# EAGLE design ir_remote_controlled_veh (EAGLE 9.0.1)
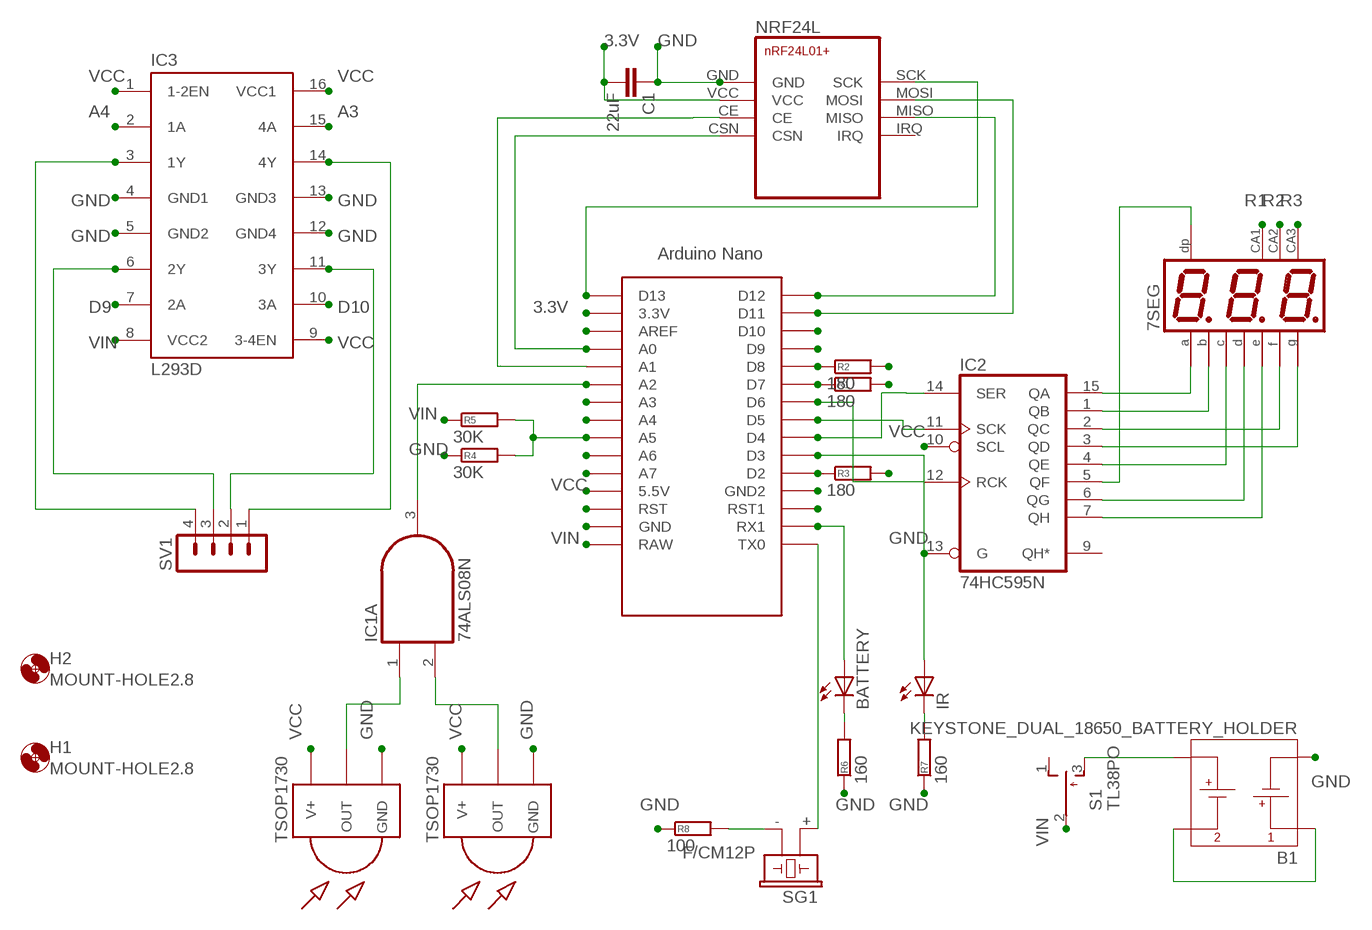
[diagram p0: schematic, sheet 1]

## Parts
7SEG  BA56-12EWA  [BA56-12EWA]
B1  KEYSTONE_DUAL_18650_BATTERY_HOLDER  [KEYSTONE_1049_DUAL_18650_HOLDER]
BATTERY  LED5MM  [LED5MM]
C1  22uF  C-EU025-040X050  [C025-040X050]
H1  MOUNT-HOLE2.8  [2,8]
H2  MOUNT-HOLE2.8  [2,8]
IC1  74ALS08N  [DIL14]
IC2  74HC595N  [DIL16]
IC3  L293D  [DIL16]
IR  LED5MM  [LED5MM]
NRF24L  NRF24L01+  [NRF24L01+]
R1  180  R-EU_0204/7  [0204/7]
R2  180  R-EU_0204/7  [0204/7]
R3  180  R-EU_0204/7  [0204/7]
R4  30K  R-EU_0204/7  [0204/7]
R5  30K  R-EU_0204/7  [0204/7]
R6  160  R-EU_0204/7  [0204/7]
R7  160  R-EU_0204/7  [0204/7]
R8  100  R-EU_0204/7  [0204/7]
S1  TL38PO  [TL3XPO]
SG1  F/CM12P  [F/CM12P]
SV1  MA04-1  [MA04-1]
TSOP1  TSOP1730  [TSOP17XX]
TSOP2  TSOP1730  [TSOP17XX]
U$1  NANO  [NANO]

## Nets
3.3V: C1.2 NRF24L.VCC U$1.3.3V
A0: NRF24L.CSN U$1.A0
A1: NRF24L.CE U$1.A1
A2: IC1.3(A:O) U$1.A2
A3: IC3.15(4A) U$1.A3
A4: IC3.2(1A) U$1.A4
A5: R4.2 R5.2 U$1.A5
D2: R3.1 U$1.D2
D3: IR.A U$1.D3
D4: IC2.14(SER) U$1.D4
D5: IC2.11(SCK) U$1.D5
D6: IC2.12(RCK) U$1.D6
D7: R1.1 U$1.D7
D8: R2.1 U$1.D8
D9: IC3.7(2A) U$1.D9
D10: IC3.10(3A) U$1.D10
D11: NRF24L.MOSI U$1.D11
D12: NRF24L.MISO U$1.D12
D13: NRF24L.SCK U$1.D13
GND: B1.C1_N(1_N) C1.1 IC2.13(G) IC3.4(GND1) IC3.5(GND2) IC3.12(GND4) IC3.13(GND3) NRF24L.GND R4.1 R6.1 R7.1 R8.1 TSOP1.GND TSOP2.GND U$1.GND U$1.GND1(GND2)
N$1: 7SEG.P$11(A) IC2.15(QA)
N$2: 7SEG.P$7(B) IC2.1(QB)
N$3: 7SEG.P$10(F) IC2.2(QC)
N$4: 7SEG.P$5(G) IC2.3(QD)
N$5: 7SEG.P$4(C) IC2.4(QE)
N$6: 7SEG.P$3(DP) IC2.5(QF)
N$7: 7SEG.P$2(D) IC2.6(QG)
N$8: 7SEG.P$1(E) IC2.7(QH)
N$9: B1.C1_P(1_P) B1.C2_N(2_N)
N$12: B1.C2_P(2_P) S1.3(S)
N$13: U$1.RST1
N$15: SG1.+ U$1.TX0
N$16: BATTERY.K(C) R6.2
N$17: IR.K(C) R7.2
N$18: U$1.RST
N$19: R8.2 SG1.-
N$20: U$1.A7
N$21: U$1.A6
N$23: IC1.1(A:I0) TSOP1.OUT
N$24: IC1.2(A:I1) TSOP2.OUT
N$27: IC3.6(2Y) SV1.3
N$30: U$1.AREF
N$32: IC3.3(1Y) SV1.4
N$37: IC3.14(4Y) SV1.1
N$41: IC3.11(3Y) SV1.2
R1: 7SEG.P$8(CA) R1.2
R2: 7SEG.P$9(CA) R2.2
R3: 7SEG.P$12(CA) R3.2
RX1: BATTERY.A U$1.RX1
VCC: IC2.10(SCL) IC3.1(1-2EN) IC3.9(3-4EN) IC3.16(VCC1) TSOP1.V+ TSOP2.V+ U$1.5V(5.5V)
VIN: IC3.8(VCC2) R5.1 S1.2(P) U$1.RAW
Unconnected: IC1.4(B:I0) IC1.5(B:I1) IC1.6(B:O) IC1.8(C:O) IC1.9(C:I0) IC1.10(C:I1) IC1.11(D:O) IC1.12(D:I0) IC1.13(D:I1) IC2.9(QH*) NRF24L.IRQ S1.1(O)

## Power pins joined to a net without a drawn wire
GND: IC1.7(P:GND) IC2.8(GND)
VCC: IC1.14(P:VCC) IC2.16(VCC)

## Library data of the parts
7SEG = dd_7segment:BA56-12EWA
B1 = dd_goldpin:KEYSTONE_DUAL_18650_BATTERY_HOLDER: Keystone Electronics Dual 18650 Battery Holder Heat-resistant nylon 18650 battery holder with 4 through-hole terminals. Octopart Search <https://octopart.com/search?q=keystone+1049> Added 2017-02-21; MANUF: Keystone Electronics; PARTNUM: 1049
BATTERY IR = dd_led:LED: LED OSRAM: - CHIPLED LG R971, LG N971, LY N971, LG Q971, LY Q971, LO R971, LY R971 LH N974, LH R974 LS Q976, LO Q976, LY Q976 LO Q996 - Hyper CHIPLED LW Q18S LB Q993, LB Q99A, LB R99A - SideLED LS A670, LO A670, LY A670, LG A670, LP A670 LB A673, LV A673, LT A673, LW A673 LH A674 LY A675 LS A676, LA A676, LO A676, LY A676, LW A676 LS A679, LY A679, LG A679 - Hyper Micro SIDELED® LS Y876, LA Y876, LO Y876, LY Y876 LT Y87S - SmartLED LW L88C, LW L88S LB L89C, LB L89S, LG L890 LS L89K, LO L89K, LY L89K LS L896, LA L896, LO L896, LY L896 - TOPLED LS T670, LO T670, LY T670, LG T670, LP T670 LSG T670, LSP T670, LSY T670, LOP T670, LYG T670 LG T671, LOG T671, LSG T671 LB T673, LV T673, LT T673, LW T673 LH T674 LS T676, LA T676, LO T676, LY T676, LB T676, LH T676, LSB T676, LW T676 LB T67C, LV T67C, LT T67C, LS T67K, LO T67K, LY T67K, LW E67C LS E67B, LA E67B, LO E67B, LY E67B, LB E67C, LV E67C, LT E67C LW T67C LS T679, LY T679, LG T679 LS T770, LO T770, LY T770, LG T770, LP T770 LB T773, LV T773, LT T773, LW T773 LH T774 LS E675, LA E675, LY E675, LS T675 LS T776, LA T776, LO T776, LY T776, LB T776 LHGB T686 LT T68C, LB T68C - Hyper Mini TOPLED® LB M676 - Mini TOPLED Santana® LG M470 LS M47K, LO M47K, LY M47K Source: http://www.osram.convergy.de LUXEON: - LUMILED® LXK2-PW12-R00, LXK2-PW12-S00, LXK2-PW14-U00, LXK2-PW14-V00 LXK2-PM12-R00, LXK2-PM12-S00, LXK2-PM14-U00 LXK2-PE12-Q00, LXK2-PE12-R00, LXK2-PE12-S00, LXK2-PE14-T00, LXK2-PE14-U00 LXK2-PB12-K00, LXK2-PB12-L00, LXK2-PB12-M00, LXK2-PB14-N00, LXK2-PB14-P00, LXK2-PB14-Q00 LXK2-PR12-L00, LXK2-PR12-M00, LXK2-PR14-Q00, LXK2-PR14-R00 LXK2-PD12-Q00, LXK2-PD12-R00, LXK2-PD12-S00 LXK2-PH12-R00, LXK2-PH12-S00 LXK2-PL12-P00, LXK2-PL12-Q00, LXK2-PL12-R00 Source: www.luxeon.com KINGBRIGHT: KA-3528ASYC Source: www.kingbright.com
C1 = dd_goldpin:C-EU: CAPACITOR, European symbol
H1 H2 = holes:MOUNT-HOLE: MOUNTING HOLE with drill center marker
IC1 = dd_AND_gate:74*08: Quad 2-input AND gate
IC2 = dd_shift_register:74*595: 8-bit SHIFT REGISTER, output latch
IC3 = dd_293d:L293D: PUSH-PULL 4 CHANNEL DRIVER; MPN: L293D; OC_FARNELL: 9589619; OC_NEWARK: 56P8249
NRF24L = dd_nrf:NRF24L01+: nRF24L01+ Transceiver Module
R1-R8 = dd_resistor:R-EU_: RESISTOR, European symbol
S1 = dd_goldpin:TL38PO: TINY SWITCH ON OFF MOM Source: http://www2.produktinfo.conrad.com/datenblaetter/700000-724999/705152-da-01-de-Subminiaturschalter_TL_36YO.pdf
SG1 = dd_goldpin:F/CM12P: BUZZER Source: Buerklin; OC_FARNELL: unknown; OC_NEWARK: unknown
SV1 = dd_goldpin:MA04-1: PIN HEADER; OC_FARNELL: unknown; OC_NEWARK: unknown
TSOP1 TSOP2 = dd_tsop-1:TSOP1730: IR Receiver and Demodulator
U$1 = dd_nano:NANO: Arduino Nano

## Board
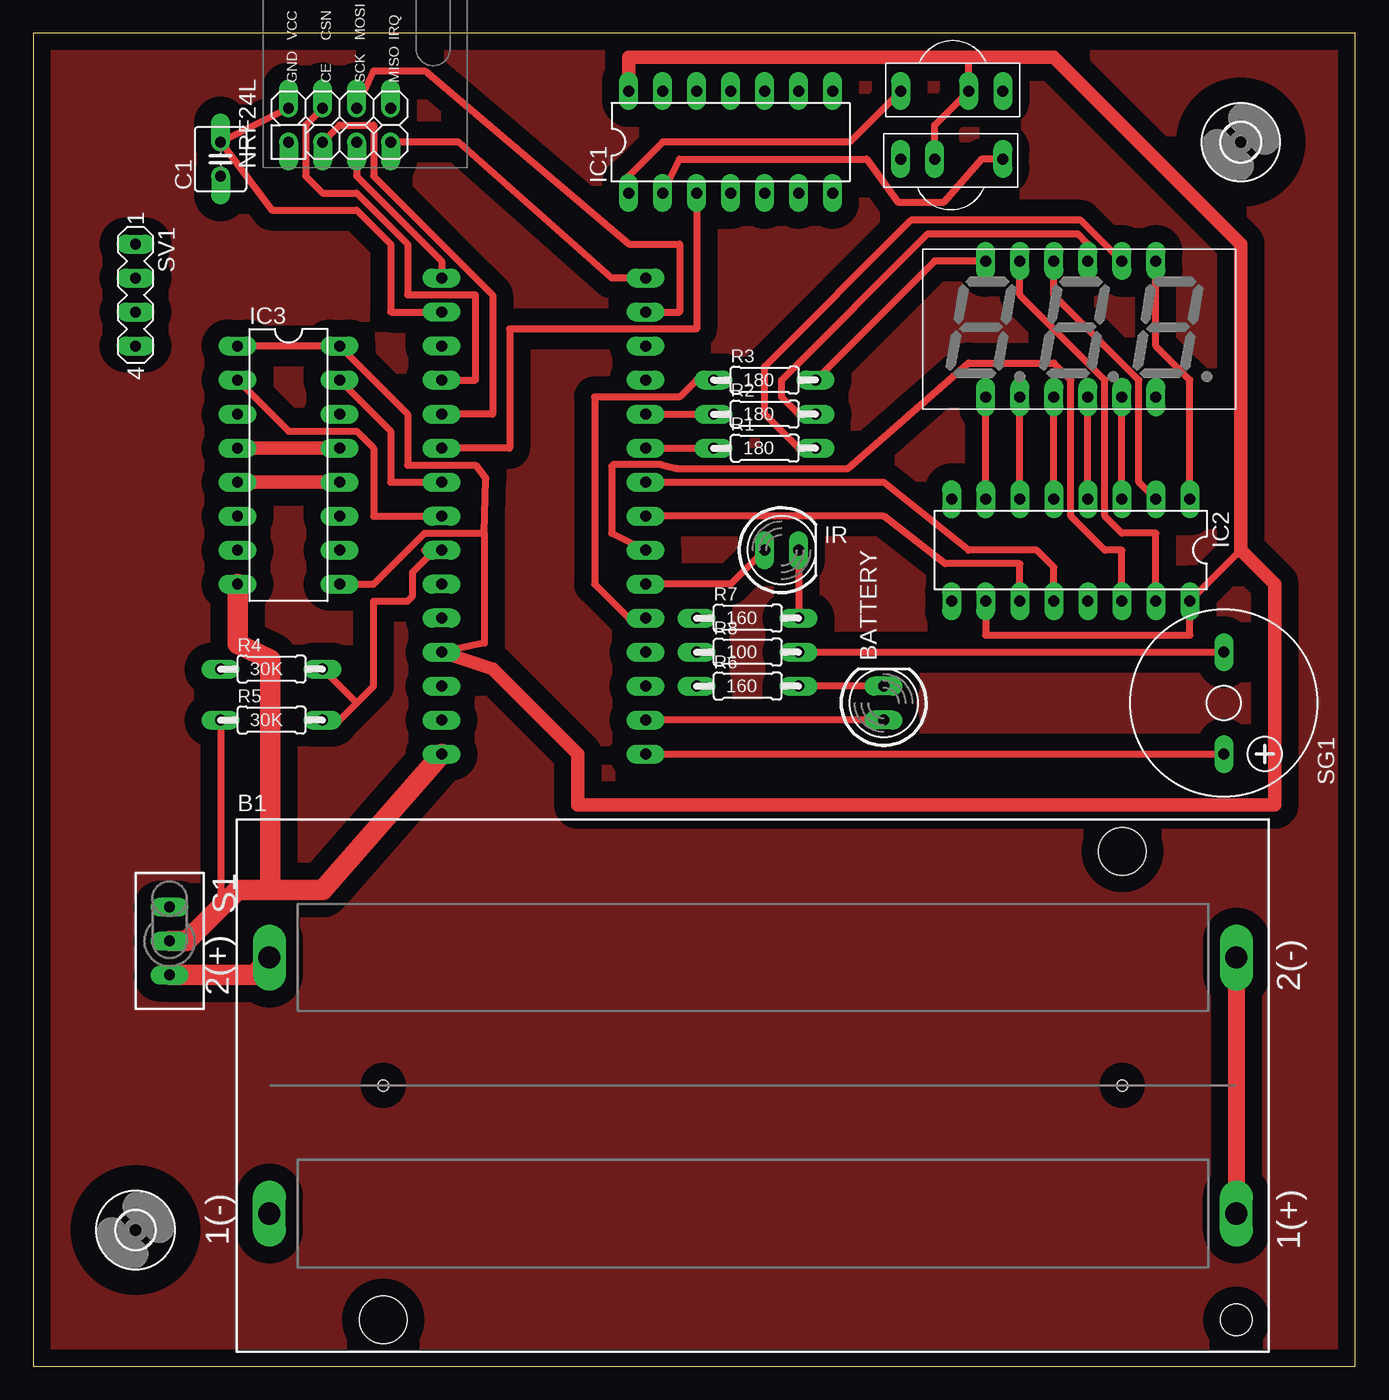
[diagram p1: board, top side]
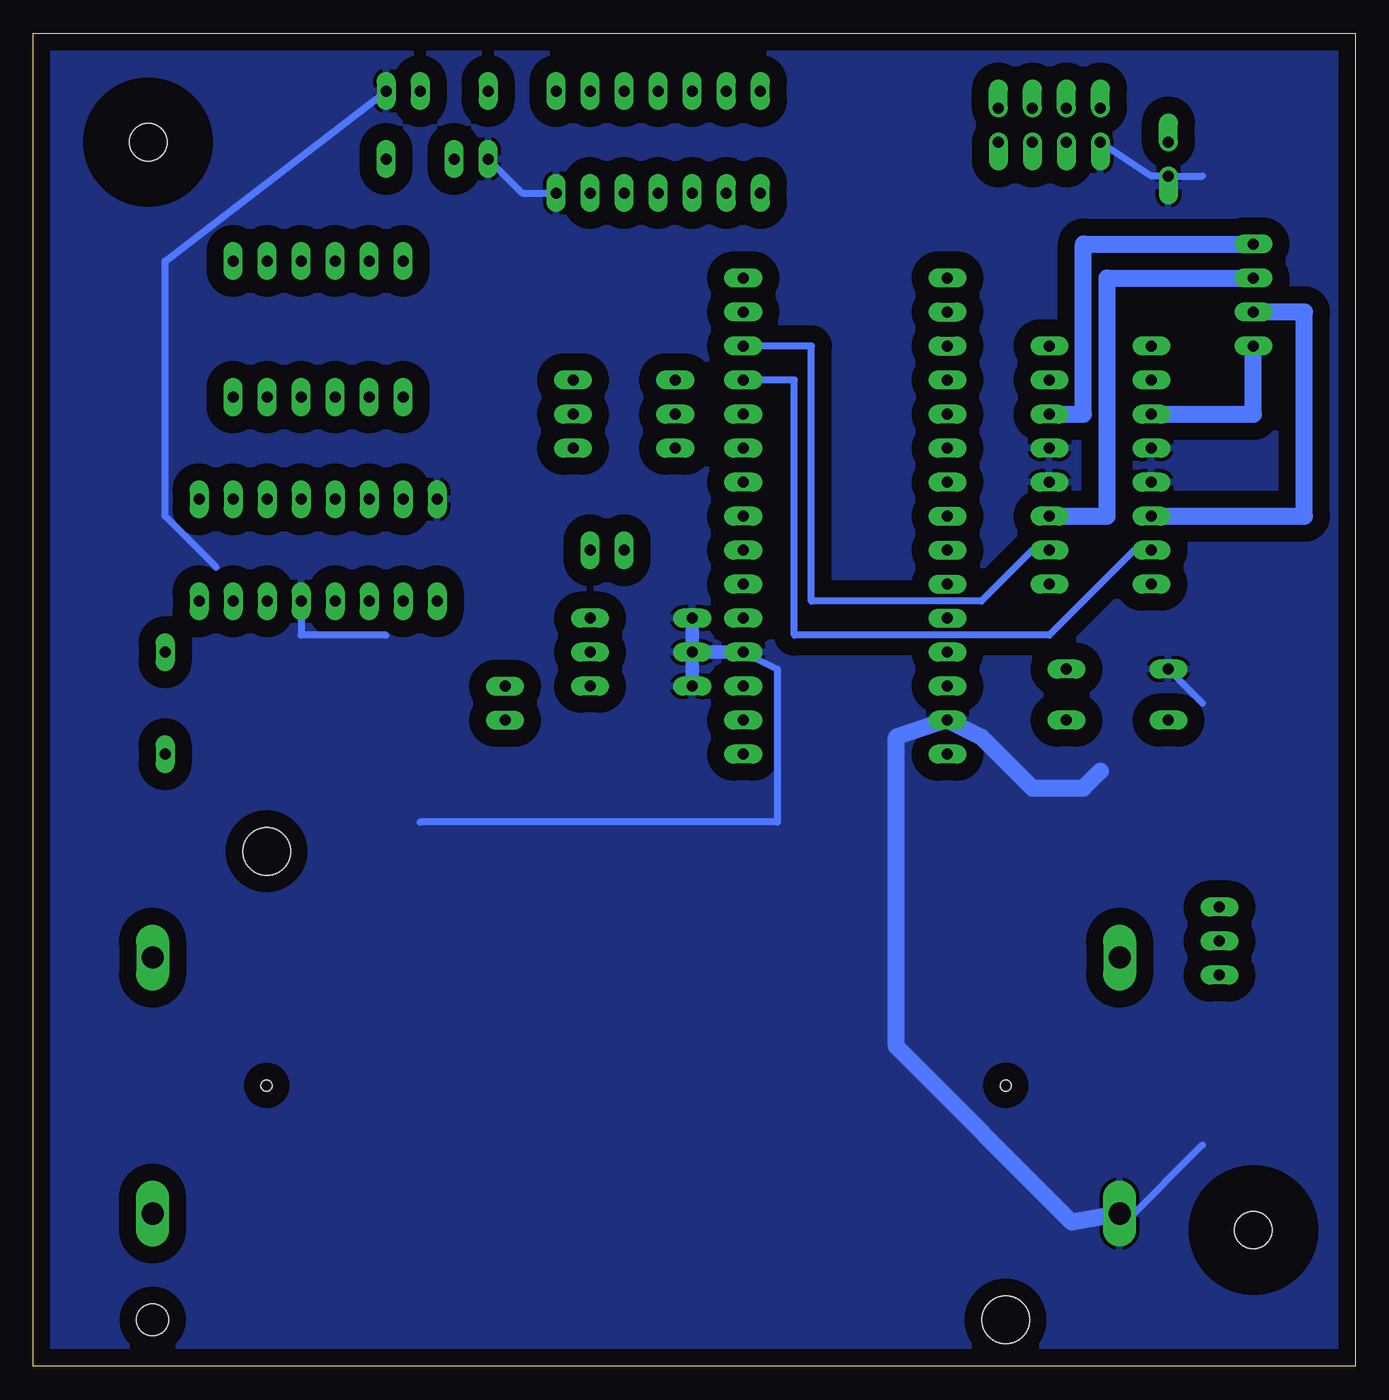
[diagram p2: board, bottom side, seen from below]

Size 98.73 x 99.56 mm. Coordinates in mm from the lower left corner, seen from the top.
Outline: 0,0 98.73,0 98.73,99.56 0,99.56 0,0
Copper layers (1*16): Top 0.035mm / dielectric 1.5mm / Bottom 0.035mm
Design rules "default *": minimum track width 6mil, minimum drill 0.35mm, track to track 10mil, track to pad 10mil, pad to pad 10mil, via to via 6mil, smd to smd 6mil, copper to edge 40mil, drill to drill 6mil, minimum pad ring 10mil, minimum via ring 8mil, stop-mask expansion 4mil, vias tented up to drill 0mil, thermal gap 10mil

### Footprints (pad centres in the part's own frame; a part is rotated, then mirrored left to right if it is on the bottom)
BA56-12EWA = drill 0.813 pad 1.422 long: P$1 -6.35,-7.62; P$2 -3.81,-7.62; P$3 -1.27,-7.62; P$4 1.27,-7.62; P$5 3.81,-7.62; P$6 6.35,-7.62; P$7 6.35,2.54; P$8 3.81,2.54; P$9 1.27,2.54; P$10 -1.27,2.54; P$11 -3.81,2.54; P$12 -6.35,2.54
KEYSTONE_1049_DUAL_18650_HOLDER = drill 1.651 pad 1.93 long: C1_N -36.11,-9.565; C1_P 36.11,-9.565; C2_N 36.11,9.565; C2_P -36.11,9.565 | hole 0.813: 27.6,0; -27.6,0 | hole 3.556: 27.6,17.5; -27.6,-17.5 | hole 2.388: 36.11,-17.5
LED5MM = drill 0.813 pad 1.422 long: A -1.27,0; K 1.27,0
C025-040X050 = drill 0.813 pad 1.422 offset: 1 -1.27,0; 2 1.27,0
2,8 = hole 2.8: 0,0
DIL14 = drill 0.813 pad 1.422 long: 1 -7.62,-3.81; 2 -5.08,-3.81; 3 -2.54,-3.81; 4 0,-3.81; 5 2.54,-3.81; 6 5.08,-3.81; 7 7.62,-3.81; 8 7.62,3.81; 9 5.08,3.81; 10 2.54,3.81; 11 0,3.81; 12 -2.54,3.81; 13 -5.08,3.81; 14 -7.62,3.81
DIL16 = drill 0.813 pad 1.422 long: 1 -8.89,-3.81; 2 -6.35,-3.81; 3 -3.81,-3.81; 4 -1.27,-3.81; 5 1.27,-3.81; 6 3.81,-3.81; 7 6.35,-3.81; 8 8.89,-3.81; 9 8.89,3.81; 10 6.35,3.81; 11 3.81,3.81; 12 1.27,3.81; 13 -1.27,3.81; 14 -3.81,3.81; 15 -6.35,3.81; 16 -8.89,3.81
NRF24L01+ = drill 0.813 pad 1.422 offset: CE -11.43,1.27; CSN -8.89,1.27; GND -11.43,3.81; IRQ -8.89,-3.81; MISO -11.43,-3.81; MOSI -8.89,-1.27; SCK -11.43,-1.27; VCC -8.89,3.81
0204/7 = drill 0.813 pad 1.422 long: 1 -3.81,0; 2 3.81,0
TL3XPO = drill 0.813 pad 1.422 long: 1 -2.54,0; 2 0,0; 3 2.54,0
F/CM12P = drill 0.813 pad 1.422 long: + 3.81,0; - -3.81,0
MA04-1 = drill 0.813 pad 1.422 long: 1 -3.81,0; 2 -1.27,0; 3 1.27,0; 4 3.81,0
TSOP17XX = drill 0.813 pad 1.422 long: GND -3.81,0; OUT 3.81,0; V+ -1.27,0
NANO = drill 0.813 pad 1.422 long: 3.3V -10.16,24.13; 5V -10.16,-1.27; A0 -10.16,19.05; A1 -10.16,16.51; A2 -10.16,13.97; A3 -10.16,11.43; A4 -10.16,8.89; A5 -10.16,6.35; A6 -10.16,3.81; A7 -10.16,1.27; AREF -10.16,21.59; D2 5.08,1.27; D3 5.08,3.81; D4 5.08,6.35; D5 5.08,8.89; D6 5.08,11.43; D7 5.08,13.97; D8 5.08,16.51; D9 5.08,19.05; D10 5.08,21.59; D11 5.08,24.13; D12 5.08,26.67; D13 -10.16,26.67; GND -10.16,-6.35; GND1 5.08,-1.27; RAW -10.16,-8.89; RST -10.16,-3.81; RST1 5.08,-3.81; RX1 5.08,-6.35; TX0 5.08,-8.89

### Placement (x,y rotation side)
7SEG  77.47,80.01 0 top
B1  53.72,20.95 0 top
BATTERY  63.5,49.53 90 top
C1  13.97,90.17 90 top
H1  90.17,91.44 0 top
H2  7.62,10.16 0 top
IC1  52.07,91.44 0 top
IC2  77.47,60.96 180 top
IC3  19.05,67.31 270 top
IR  55.88,60.96 0 top
NRF24L  22.86,102.87 90 top
R1  54.61,68.58 0 top
R2  54.61,71.12 0 top
R3  54.61,73.66 0 top
R4  17.78,52.07 0 top
R5  17.78,48.26 0 top
R6  53.34,50.8 0 top
R7  53.34,55.88 0 top
R8  53.34,53.34 0 top
S1  10.16,31.75 270 top
SG1  88.9,49.53 270 top
SV1  7.62,80.01 270 top
TSOP1  68.58,95.25 180 top
TSOP2  68.58,90.17 0 top
U$1  40.64,54.61 0 top

### Tracks (layer width: path | path; a pad name or v marks a point on that pad's centre or on a via)
3.3V
  Top 0.508: NRF24L.VCC C1.2 17.78,86.36 24.13,86.36 26.67,83.82 26.67,78.74 U$1.3.3V
A0
  Top 0.508: U$1.A0 33.02,73.66 33.02,80.01 27.94,80.01 27.94,83.82 24.13,87.63 21.59,87.63 20.32,88.9 20.32,92.71 NRF24L.CSN
A1
  Top 0.508: NRF24L.CE 22.86,92.71 25.4,92.71 25.4,88.9 34.29,80.01 34.29,71.12 U$1.A1
A2
  Top 0.508: IC1.3 49.53,77.47 35.56,77.47 35.56,68.58 U$1.A2
A3
  Top 0.508: IC3.15 26.67,69.85 26.67,66.04 U$1.A3
A4
  Top 0.508: IC3.2 19.05,69.85 24.13,69.85 25.4,68.58 25.4,63.5 U$1.A4
A5
  Top 0.508: R5.2 22.86,48.26 24.13,49.53 | 24.13,49.53 R4.2 | 24.13,49.53 25.4,50.8 25.4,57.15 27.94,57.15 28.32,57.53 28.32,59.31 29.97,60.96 U$1.A5 29.21,60.96
D2
  Top 0.508: R3.1 49.53,73.66 48.26,72.39 41.91,72.39 41.91,58.42 44.45,55.88 U$1.D2
D3
  Top 0.508: U$1.D3 52.07,58.42 IR.A
D4
  Top 0.508: U$1.D4 43.18,62.23 43.18,67.2 43.34,67.36 46.86,67.36 48.06,67.06 60.83,67.06 69.85,74.93 76.2,74.93 77.47,73.66 77.47,63.5 80.01,60.96 81.28,60.96 IC2.14
D5
  Top 0.508: U$1.D5 63.5,63.5 68.07,59.94 73.66,59.94 IC2.11
D6
  Top 0.508: U$1.D6 63.5,66.04 69.85,60.96 74.93,60.96 76.2,59.69 IC2.12 76.2,57.53
D7
  Top 0.508: U$1.D7 R1.1
D8
  Top 0.508: U$1.D8 R2.1
D9
  Bottom 0.508: U$1.D9 41.91,73.66 41.91,54.61 22.86,54.61 16.51,60.96 IC3.7
D10
  Bottom 0.508: IC3.10 24.13,60.96 27.94,57.15 40.64,57.15 40.64,76.2 U$1.D10
D11
  Top 0.508: U$1.D11 48.26,78.74 48.26,83.82 44.45,83.82 29.21,96.77 25.4,96.77 NRF24L.MOSI
D12
  Top 0.508: U$1.D12 43.18,81.28 31.75,91.44 NRF24L.MISO
D13
  Top 0.508: U$1.D13 30.48,82.55 24.13,88.9 NRF24L.SCK
GND
  Top 1.016: IC3.4 IC3.13 | IC3.5 IC3.12
  Bottom 0.508: R4.1 11.43,49.53 | 11.43,16.51 17.18,10.76 B1.C1_N | 64.88,90.17 TSOP2.GND 62.23,87.63 IC1.7 | 85.09,59.69 88.9,63.5 88.9,82.55 TSOP1.GND | IC2.13 78.74,54.61 72.39,54.61 | U$1.GND1 43.18,52.07 43.18,40.64 69.85,40.64 | NRF24L.GND 15.24,88.9 C1.1 11.43,88.9
  Bottom 1.016: U$1.GND1 R8.1 | R8.1 R7.1 | R8.1 R6.1
  Bottom 1.27: B1.C1_N 21.17,10.76 34.29,23.88 34.29,46.99 U$1.GND 27.94,46.99 24.13,43.18 20.32,43.18 19.05,44.45
  pour Bottom (isolate 1.27): -1.27,100.33 99.06,99.06 99.06,-1.27 -1.27,0
N$1
  Top 0.508: 7SEG.P$11 73.66,80.01 80.01,73.66 80.01,63.5 81.28,62.23 83.82,62.23 IC2.15
N$2
  Top 0.508: IC2.1 86.36,73.66 83.82,76.2 7SEG.P$7
N$3
  Top 0.508: IC2.2 82.55,66.04 82.55,73.66 76.2,80.01 7SEG.P$10
N$4
  Top 0.508: IC2.3 7SEG.P$5
N$5
  Top 0.508: IC2.4 7SEG.P$4
N$6
  Top 0.508: IC2.5 7SEG.P$3
N$7
  Top 0.508: IC2.6 7SEG.P$2
N$8
  Top 0.508: IC2.7 7SEG.P$1
N$9
  Top 1.27: B1.C2_N B1.C1_P
N$12
  Top 1.524: B1.C2_P 16.55,29.21 S1.3
N$15
  Top 0.508: U$1.TX0 SG1.+
N$16
  Top 0.508: BATTERY.K R6.2
N$17
  Top 0.508: IR.K R7.2
N$19
  Top 0.508: R8.2 SG1.-
N$23
  Top 0.508: TSOP1.OUT 60.96,91.44 46.99,91.44 44.45,88.9 IC1.1
N$24
  Top 0.508: IC1.2 48.26,90.17 62.23,90.17 64.54,86.97 68,86.97 70.82,90.17 TSOP2.OUT
N$25
  pour Top (isolate 1.27): 0,100.33 99.06,100.33 99.06,0 0,0
N$27
  Bottom 1.27: IC3.6 3.81,63.5 3.81,78.74 SV1.3
N$32
  Bottom 1.27: IC3.3 7.62,71.12 SV1.4
N$37
  Bottom 1.27: IC3.14 20.32,71.12 20.32,83.82 SV1.1
N$41
  Bottom 1.27: IC3.11 18.54,63.5 18.54,81.28 SV1.2
R1
  Top 0.508: 7SEG.P$8 78.23,85.6 65.53,85.6 54.61,74.68 54.61,71.12 57.15,68.58 R1.2
R2
  Top 0.508: 7SEG.P$9 78.74,83.82 77.98,84.58 66.8,84.58 55.88,73.66 55.88,72.39 57.15,71.12 R2.2
R3
  Top 0.508: 7SEG.P$12 67.31,82.55 R3.2
RX1
  Top 0.508: BATTERY.A U$1.RX1
VCC
  Top 0.508: 33.68,62.23 33.68,54 U$1.5V | TSOP2.V+ 67.31,92.71 TSOP1.V+ 69.85,97.79 76.2,97.79 | 90.17,60.96 IC2.16 86.36,54.61 71.12,54.61 IC2.10 | IC3.1 IC3.16 27.94,71.12 27.94,67.31 33.02,67.31 33.78,66.29 33.68,62.23 | IC3.9 25.4,58.42 29.21,62.23 33.68,62.23
  Top 1.016: IC1.14 44.45,97.79 76.2,97.79 90.17,83.82 90.17,60.96 92.71,58.42 92.71,41.91 40.64,41.91 40.64,45.72 34.29,52.07 U$1.5V
VIN
  Top 0.508: R5.1 13.97,34.29
  Top 1.524: U$1.RAW 21.59,35.56 16.51,35.56 | 16.51,35.56 15.24,35.56 13.97,34.29 11.43,31.75 S1.2 | IC3.8 15.24,53.95 17.68,52.79 17.68,35.66 16.51,35.56